# Altium schematic sheet Sheet2.SchDoc
size A4; SheetNumber: 2; SheetTotal: 2
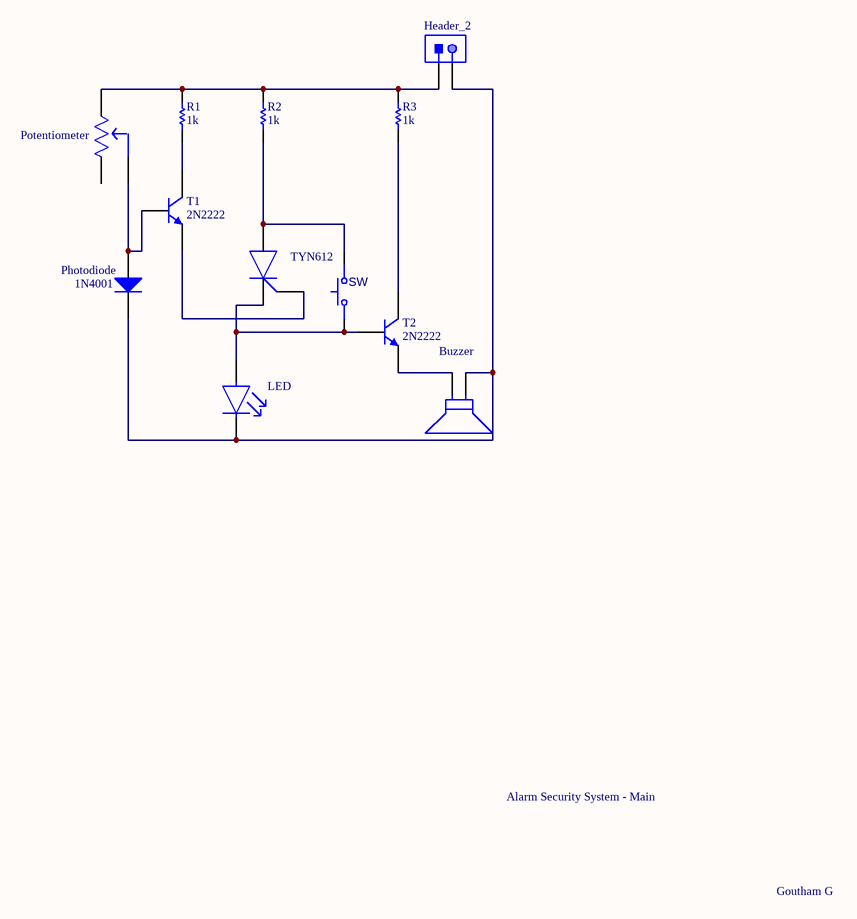
[diagram p0: Sheet2.SchDoc]

## Parts
100K  Potentiometer  [FP-3266W-MFG]
Buzzer  Buzzer  [FP-PKM22EPPH4001-B0-MFG]
Header_2  B2P-VH(LF)(SN)  [JST-B2P-VH(LF)(SN)_V]  (value not drawn)
LED  LED  [FP-HLMP-1719-MFG]  (value not drawn)
Photodiode  1N4001  [DIOD-DO-41-P-2_V]
R1  value 1k  [RESC2013X70X40ML20T20]  (hidden comment: Resistor 1k +/-1% 0805 125 mW)
R2  value 1k  [RESC2013X70X40ML20T20]  (hidden comment: Resistor 1k +/-1% 0805 125 mW)
R3  value 1k  [RESC2013X70X40ML20T20]  (hidden comment: Resistor 1k +/-1% 0805 125 mW)
SW  (no value)  [OMRON-B3U-1000P-2-B_V]
T1  2N2222  [MLTC-TO-18-3]
T2  2N2222  [MLTC-TO-18-3]
TYN612  TYN612  [SIP450W75P254L1000H1920Q3_PRSS0003AF-A_N]  (value not drawn)

## Nets
Net100K_1: 100K.1(CCW) Header_2.1 R1.2 R2.2 R3.2
Net100K_2: 100K.2(WIPER) Photodiode.1(A) T1.2(B)
NetBuzzer_1: Buzzer.1 Header_2.2 LED.1(C) Photodiode.2(K)
NetBuzzer_2: Buzzer.2 T2.1(E)
NetLED_2: LED.2(A) SW.1 T2.2(B) TYN612.1(CATHODE)
NetR1_1: R1.1 T1.3(C)
NetR2_1: R2.1 SW.2 TYN612.2(ANODE)
NetR3_1: R3.1 T2.3(C)
NetT1_1: T1.1(E) TYN612.3(GATE)

Not connected (* = marked no-connect by the designer): 100K 3(CW)

## Notes on the sheet
- Alarm Security System - Main
- Goutham G

## Library data of the parts
100K = CMP-07234-000016-1: TRIMMER 100K OHM 0.25W PC PIN TOP; Manufacturer: Bourns; Manufacturer Part Number: 3266W-1-103LF; Temperature Coefficient: 100ppm/°C; Tolerance: 10%; Value: 100kΩ; Resistance: 0; Standoff Height: 0.43mm; Device Class L3: Variable Resistors and Potentiometers; ComponentLink2URL: https://www.bourns.com/docs/Product-Datasheets/3266.pdf; ComponentLink2Description: Datasheet; Device Class L2: Resistors; Power Rating: 0.25W; Mouser Description: Trimmer Resistors - Through Hole 1/4 10Kohms 10% SQ W/Standoff Sealed; Category: Res; Digikey Description: TRIMMER 10K OHM 0.25W PC PIN TOP; Device Class L1: Passive Components; Octopart: https://octopart.com/3266w-1-103lf-bourns-81445; Height: 9.02mm; Temperature Range High: +125°C; Series: 3266; Temperature Range Low: -55°C; Composition: Cermet; Lead Free: Yes; RoHS: TRUE; Automotive: No; Package: 3266W; Temperature: -55°C to +125°C
Buzzer = CMP-2000-06903-2: AUDIO PIEZO TRANSDUCER 30V TH; Voltage Rating: 3V; Frequency: 4kHz; Capacitance: 12nF; Max Supply Voltage: 25V; Washable: No; Packaging: Bulk; Mount: Through Hole; Height: 7mm; Diameter: 22mm; Min Operating Temperature: -20°C; Self Resonant Frequency: 4kHz; Package Quantity: 900; Lead Free: Lead Free; REACH SVHC: No SVHC; Termination: Solder; Nominal Input Voltage: 3V; Max Frequency: 4kHz; Radiation Hardening: No; Max Operating Temperature: 70°C
Header_2 = CMP-002-00025-2: Male Header, Pitch 3.96 mm, 1 x 2 Position, Height 10.9 mm, Tail Length 3.7 mm, -25 to 85 degC, RoHS, Bulk; Manufacturer: JST; Case/Package: B2P-VH(LF)(SN); Connector Type: Header; Mounting Technology: TH; Package Reference: B2P-VH(LF)(SN); Package Description: Male Header, Pitch 3.96 mm, 1 x 2 Position, Height 10.9 mm, Tail Length 3.7 mm; Max Operating Temperature: 85°C; Manufacturer URL: http://www.jst.com/home2.html; RoHS Compliant: Unknown; Datasheet Version: May-16; Gender: Male; Min Operating Temperature: -25°C; Datasheet URL: http://www.jst-mfg.com/product/pdf/eng/eVH.pdf
LED = CMP-2000-06410-2: LED YELLOW DIFFUSED T-1 T/H; Manufacturer: Broadcom; Wavelength: 585nm; Led Orientation: Straight; Luminous Intensity: 2.1mcd; Forward Voltage: 1.8V; Viewing Angle: 50°; Reverse Voltage: 5V; Power Dissipation: 17.5mW; Forward Current: 2mA; Lead Free: Yes; Automotive: No; Device Class L1: Optoelectronics; Mouser Description: Standard LEDs - Through Hole Yellow Diffused 585nm 2.1mcd; Digikey Description: LED YELLOW DIFFUSED T-1 T/H; Temperature: -40°C to +100°C; Temperature Range High: +100°C; Package: 0; Category: Diode; Colour: Yellow; Device Class L2: LEDs; ComponentLink2Description: Datasheet; ComponentLink2URL: https://docs.broadcom.com/docs/AV02-1557EN; Temperature Range Low: -40°C; Device Class L3: unset; Octopart: https://octopart.com/hlmp-1719-broadcom-71130405; RoHS: TRUE; Manufacturer Part Number: HLMP-1719
Photodiode = CMP-0639-00006-2: 1.0 A Rectifier, 15 pF, 50 V, -65 to 150 degC, 2-Pin DO-41 Plastic, RoHS, Tape and Reel; Manufacturer: Diodes Inc; VF (V): 1; CT (pF): 15; Max. IR (uA): 5; VRRM (V): 50; Max. IFSM (A): 30; RoHS: TRUE; Mounting Technology: Through Hole; PartNumber: 1N4001; ComponentLink2Description: Datasheet; DatasheetVersion: Rev. 8-2; Operating Temperature Range (degC): -65 to 150; Packing: Tape and Reel; PackageReference: DO-41-P-2; ComponentLink1URL: http://diodes.com/; PackageDescription: 2-Pin Axial Lead, Body 4.635 x 2.36 mm, Lead Spread 25.4 mm; ComponentLink2URL: http://diodes.com/datasheets/ds28002.pdf; Max. Average Rectified Current IO (A): 1; ComponentLink1Description: Manufacturer URL
R1-R3 = CMP-009-00010-5: Chip Resistor, 1 KOhm, +/- 1%, 0.125 W, -55 to 155 degC, 0805 (2013 Metric); Power: 125mW; Voltage Rating: 150V; Tolerance: 1%; RoHS Compliant: True; Mounting Technology: SM; Pins: 2; Case/Package: 0805; Max Operating Temperature: 155°C; Min Operating Temperature: -55°C
SW = CMP-011-00011-3: Ultra-small Surface-mounting Tactile Switches with High Contact Reliability, SPST-NO, -25 to 70 degC, 2-Pin SMD, RoHS, Tape and Reel; Voltage Rating: 12V; Current Rating: 50mA; Pins: 2; RoHS Compliant: Details
T1 T2 = CMP-2000-05237-1: Low Power Bipolar NPN Transistor, 30 V, -65 to 200 degC, 3-Pin TO-18, RoHS, Bulk; Manufacturer: Multicomp; Pin Configuration: a; No. of Pins: 3; No. of Transistors: 1; Collector Emitter Voltage Vces: 400mV; Current Ic Continuous a Max: 800mA; Power Dissipation Pd: 500mW; Collector Emitter Voltage V(br)ceo: 30V; Gain Bandwidth ft Typ: 250MHz; Voltage Vcbo: 60V; DC Current Gain hFE: 100; Full Power Rating Temperature: 25degC; Current Ic @ Vce Sat: 150mA; SVHC: NoSVHC(19-Dec-2012); Package Reference: TO-18-3; Package Description: 3-Pin Transistor Outline Package (TO-18), Dia 5.54 mm, Pitch Pitch 1.485mm; Datasheet URL: http://www.farnell.com/datasheets/1662272.pdf; Transistor Case Style: TO-18; Continuous Collector Current Ic Max: 800mA; Manufacturer URL: http://uk.farnell.com/b/multicomp; DC Collector Current: 800mA; Hfe Min: 100; Transistor Polarity: NPN; Power Dissipation Ptot Max: 500mW; Package / Case: TO-18; Datasheet Version: Rev. 1.1, 05/2012; Gain Bandwidth ft Min: 250MHz; Current Ic hFE: 150mA
TYN612 = CMP-00572-20478059-1: Silicon Controlled Rectifier, 12A I(T)RMS, 12000mA I(T), 600V V(DRM), 600V V(RRM), 1 Element, TO-220AB; Manufacturer Lifecycle Status: LAST TIME BUY; Hold Current: 15mA; RMS Current (Irms): 18.8A; RoHS: Compliant; China RoHS: Compliant; ComponentLink2URL: https://octopart.com/cad-content/api/get-model-datasheet/15189/20478059; Mount: Through Hole; Max Operating Temperature: 150°C; ComponentLink2Description: Datasheet URL; Case/Package: TO-220-3; Height: 3mm; ComponentLink1Description: Manufacturer's Website; Max Repetitive Reverse Voltage (Vrrm): 600V; Lifecycle Status: EOL; Number of Pins: 3; Min Operating Temperature: -40°C; HelpURL: https://octopart.com/cad-content/api/get-model-datasheet/15189/20478059; ComponentLink3URL: https://www.renesas.com/en/document/psc/package-drawing-220fl-3pin-prss0003af; ComponentLink1URL: http://www.renesas.com; ComponentLink3Description: Manufacturer's Package Drawing